# Altium schematic sheet TOP.SchDoc
size A3; SheetNumber: 1; SheetTotal: 9
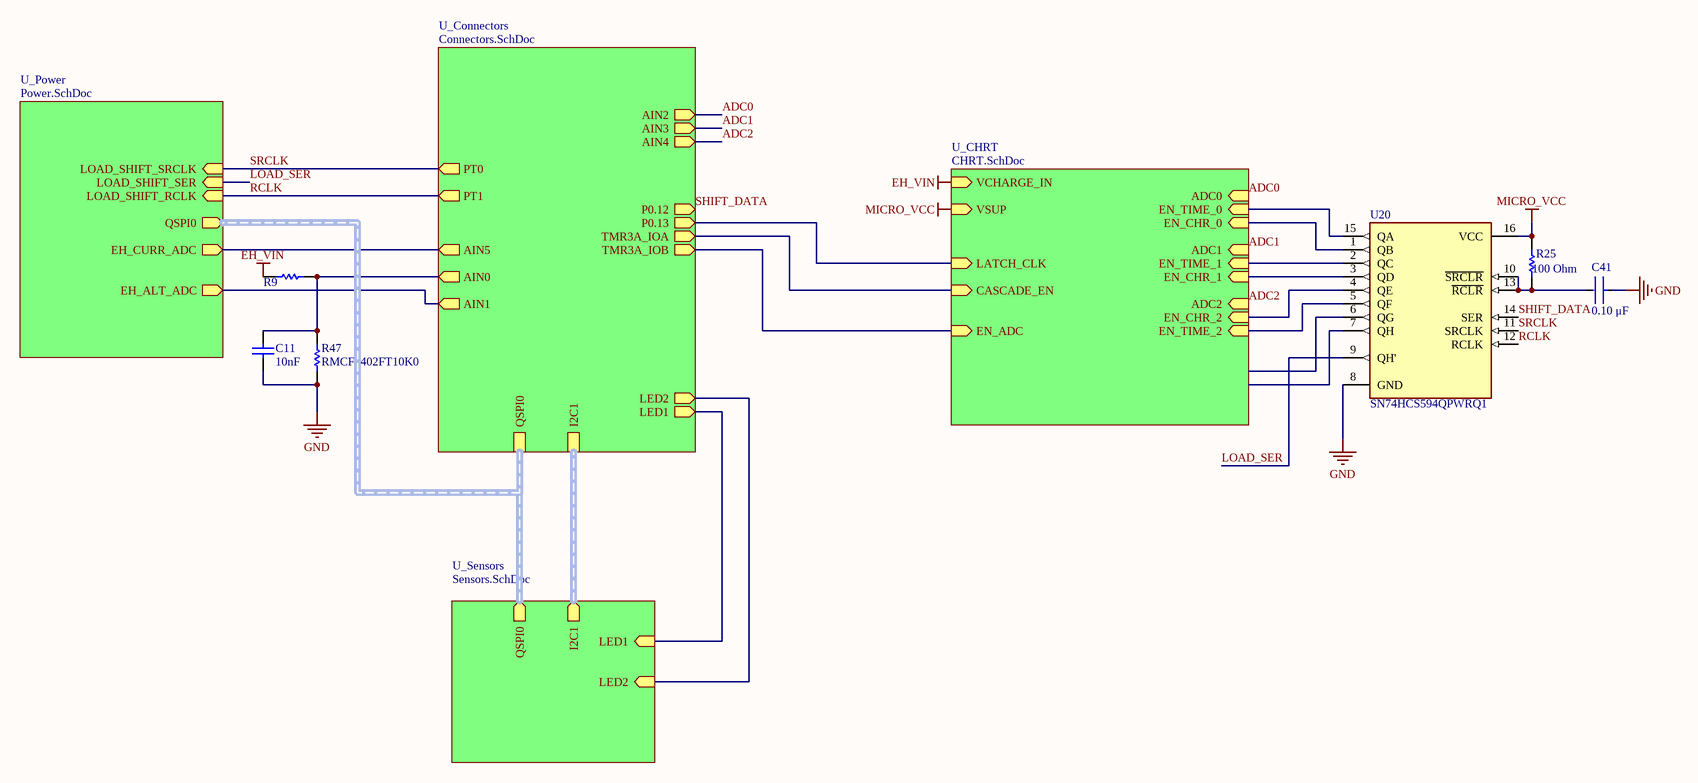
[diagram p0: TOP.SchDoc]

## Parts
C11  Capacitance: 10nF  [CAPC1608X90X35ML10T15]  (hidden comment: GRM188R71H103KA01D)
C41  Capacitance: 0.10 μF  [FP-C0402-BB-MFG]  (hidden comment: C0402C104K8PACTU)
R9  RC0402JR-075M6L  [RESC1005X40X25ML05T10]  (value not drawn)
R25  Resistance: 100 Ohm  [RESC1005X40X25LL05T05]  (hidden comment: ERJ-2RKF1000X)
R47  RMCF0402FT10K0  [RESC1005X40X25ML05T10]
U20  SN74HCS594QPWRQ1  [FP-PW0016A-IPC_A]

## Sub-sheets
U_CHRT = CHRT.SchDoc: VCHARGE_IN (in), VSUP (in), LATCH_CLK (in), CASCADE_EN (in), EN_ADC (in), ADC1 (in), EN_TIME_0 (in), ADC0 (in), EN_CHR_1 (in), EN_CHR_0 (in), EN_CHR_2 (in), EN_TIME_2 (in), EN_TIME_1 (in), ADC2 (in)
U_Connectors = Connectors.SchDoc: I2C1 (harness I2C1), QSPI0 (harness QSPI0), AIN2 (out), AIN3 (out), AIN4 (out), AIN5 (out), TMR3A_IOA (out), TMR3A_IOB (out), PT0 (out), PT1 (out), P0.12 (out), P0.13 (out), AIN0 (out), AIN1 (out), LED2 (out), LED1 (out)
U_Power = Power.SchDoc: LOAD_SHIFT_SRCLK (in), LOAD_SHIFT_SER (in), LOAD_SHIFT_RCLK (in), QSPI0 (out, harness QSPI0), EH_CURR_ADC (out), EH_ALT_ADC (out)
U_Sensors = Sensors.SchDoc: I2C1 (out, harness I2C1), QSPI0 (out, harness QSPI0), LED1 (in), LED2 (in)

## Nets
EH_VIN: R9.1 ; sheet U_CHRT/VCHARGE_IN
GND: C11.1 C41.1 R47.1 U20.8(GND)
MICRO_VCC: R25.2 U20.16(VCC) ; sheet U_CHRT/VSUP
ADC0: sheet U_Connectors/AIN2, sheet U_CHRT/ADC0
ADC1: sheet U_Connectors/AIN3, sheet U_CHRT/ADC1
ADC2: sheet U_Connectors/AIN4, sheet U_CHRT/ADC2
LOAD_SER: U20.9(QH') ; sheet U_Power/LOAD_SHIFT_SER
RCLK: U20.12(RCLK) ; sheet U_Power/LOAD_SHIFT_RCLK, sheet U_Connectors/PT1
SHIFT_DATA: U20.14(SER) ; sheet U_Connectors/P0.12
SRCLK: U20.11(SRCLK) ; sheet U_Power/LOAD_SHIFT_SRCLK, sheet U_Connectors/PT0
NetC11_2: C11.2 R9.2 R47.2 ; sheet U_Connectors/AIN0
NetC41_2: C41.2 R25.1 U20.10(~{SRCLR}) U20.13(~{RCLR})
NetU20_1: U20.1(QB) ; sheet U_CHRT/EN_CHR_0
NetU20_2: U20.2(QC) ; sheet U_CHRT/EN_TIME_1
NetU20_3: U20.3(QD) ; sheet U_CHRT/EN_CHR_1
NetU20_4: U20.4(QE) ; sheet U_CHRT/EN_CHR_2
NetU20_5: U20.5(QF) ; sheet U_CHRT/EN_TIME_2
NetU20_15: U20.15(QA) ; sheet U_CHRT/EN_TIME_0
(unnamed): sheet U_Sensors/LED1, sheet U_Connectors/LED1
(unnamed): sheet U_Sensors/LED2, sheet U_Connectors/LED2
(unnamed): sheet U_Power/EH_CURR_ADC, sheet U_Connectors/AIN5
(unnamed): sheet U_Power/EH_ALT_ADC, sheet U_Connectors/AIN1
(unnamed): sheet U_Connectors/TMR3A_IOA, sheet U_CHRT/CASCADE_EN
(unnamed): sheet U_Connectors/TMR3A_IOB, sheet U_CHRT/EN_ADC
(unnamed): sheet U_Connectors/P0.13, sheet U_CHRT/LATCH_CLK

Not connected (* = marked no-connect by the designer): U20 6(QG) 7(QH)

## Buses and harness runs
harness sheet U_Connectors/I2C1 = sheet U_Sensors/I2C1
harness sheet U_Connectors/QSPI0 = sheet U_Power/QSPI0 = sheet U_Sensors/QSPI0

## Library data of the parts
C11 = CMP-2100-03642-1: Chip Capacitor, 10 nF, +/- 10%, 50 V, -55 to 125 degC, 0603 (1608 Metric), RoHS, Tape and Reel; Manufacturer: Murata; Insulation Resistance: 10GR; Dielectric: X7R; Voltage Rating: 50V; Material: Ceramic; Package Quantity: 1; Lead Free: LeadFree; Case/Package: 0603; Termination: SMD/SMT; REACH SVHC: Unknown; Manufacturer URL: http://www.murata.com/; Datasheet URL: http://search.murata.co.jp/Ceramy/image/img/A01X/G101/ENG/GRM188R71H103KA01-01.pdf; Mount: SurfaceMount; Datasheet Version: 42401.0; Number of Pins: 2; Length: 1.6mm; Voltage: 50V; Depth: 0.8mm; Tolerance: 10%; Min Operating Temperature: -55degC; Voltage Rating (DC): 50V; Max Operating Temperature: 125degC; Package Description: 2-Pin Surface Mount Device, Body 1.6 x 0.8 mm; RoHSCompliant: True; Case Code (Imperial): 0603; Width: 0.031inch; Case Code (Metric): 1608; Height: 0.8mm; Package Reference: 0603; Packaging: TapeandReel; Thickness: 0.035inch; Dielectric Material: Ceramic
C41 = CMP-2008-02046-2: CAP CER 0.1UF 10V X5R 0402; Manufacturer: Kemet; Material: Ceramic; Temperature Coefficient: 15%; Tolerance: 0.1; Value: 0.10 μF; Package: C0402-BB; Temperature: -55°C to +125°C; ComponentLink2Description: Datasheet; Temperature Characteristic: X5R; Device Class L1: Passive Components; Height: 0.55mm; Lead Free: Yes; ComponentLink2URL: https://content.kemet.com/datasheets/KEM_C1002_X7R_SMD.pdf; Device Class L2: Capacitors; Temperature Range Low: -55°C; Temperature Range High: +125°C; RoHS: TRUE; Octopart: https://octopart.com/c0402c104k8pactu-kemet-140039; Automotive: No; Mouser Description: Capacitor 100 nF 10 VDC 0402; Category: Cap; Voltage Rating: 10 V; Digikey Description: CAP CER 0.1UF 10V X5R 0402; Ipc Land Pattern Name: CAPC10050X50; Device Class L3: Ceramic Capacitors; Manufacturer Part Number: C0402C104K8PACTU
R9 = CMP-2002-07139-1: Manufacturer: Yageo / Phycomp; Part Number: RC0402JR-075M6L
R25 = CMP-2002-00605-3: Chip Resistor, 100 Ohm, +/- 1%, 100 mW, -55 to 155 degC, 0402 (1005 Metric), RoHS, Tape and Reel; Manufacturer: Basic Passives; Power Rating: 100 mW; Voltage Rating: 50 V; Case\/Package: 0402; Width: 0.5 mm; Pins: 2; ComponentLink2Description: Datasheet; PackageReference: 0402; Height: 0.35 mm; Tolerance: 1%; DatasheetVersion: 04/2015; Case Code (Imperial): 0402; Min Operating Temperature: -55 degC; Radiation Hardening: No; Length: 1 mm; Package Quantity: 10000; PackageDescription: 2-Pin Surface Mount Device, Body 1 x 0.5 mm; Mounting Technology: Surface Mount; Case Code (Metric): 1005; Packaging: Tape and Reel; ComponentLink1URL: http://www.panasonic.com/; RoHSCompliant: true; Max Operating Temperature: 155 degC; REACH SVHC: Yes; PartNumber: ERJ-2RKF1000X; ComponentLink1Description: Manufacturer URL; ComponentLink2URL: http://industrial.panasonic.com/cdbs/www-data/pdf/RDA0000/AOA0000C86.pdf; Mount: Surface Mount
R47 = CMP-2002-07490-1: Manufacturer: Yageo / Phycomp; Part Number: RC0402FR-071ML
U20 = CMP-04904-000006-1: AUTOMOTIVE 8-BIT SHIFT REGISTERS